# EAGLE design connector_boards (EAGLE 9.1.3)
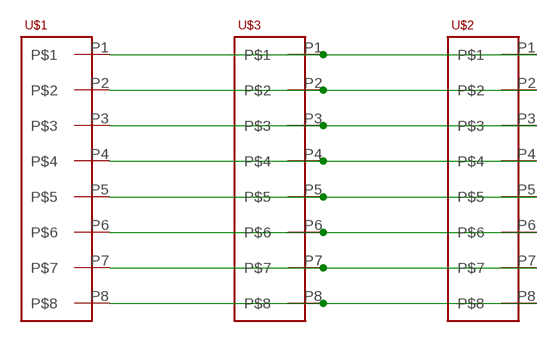
[diagram p0: schematic, sheet 1]

## Parts
U$1  8-PIN-MOLEX-RA-FEMALE  [8-PIN-MOLEX]
U$2  8-PIN-MOLEX-RA-FEMALE  [8-PIN-MOLEX]
U$3  8-PIN-MOLEX-RA-FEMALE  [8-PIN-MOLEX]

## Nets
N$1: U$1.P1 U$2.P1 U$3.P1
N$2: U$1.P2 U$2.P2 U$3.P2
N$3: U$1.P3 U$2.P3 U$3.P3
N$4: U$1.P4 U$2.P4 U$3.P4
N$5: U$1.P5 U$2.P5 U$3.P5
N$6: U$1.P6 U$2.P6 U$3.P6
N$7: U$1.P7 U$2.P7 U$3.P7
N$8: U$1.P8 U$2.P8 U$3.P8

## Library data of the parts
U$1-U$3 = master_library:8-PIN-MOLEX-RA-FEMALE

## Board
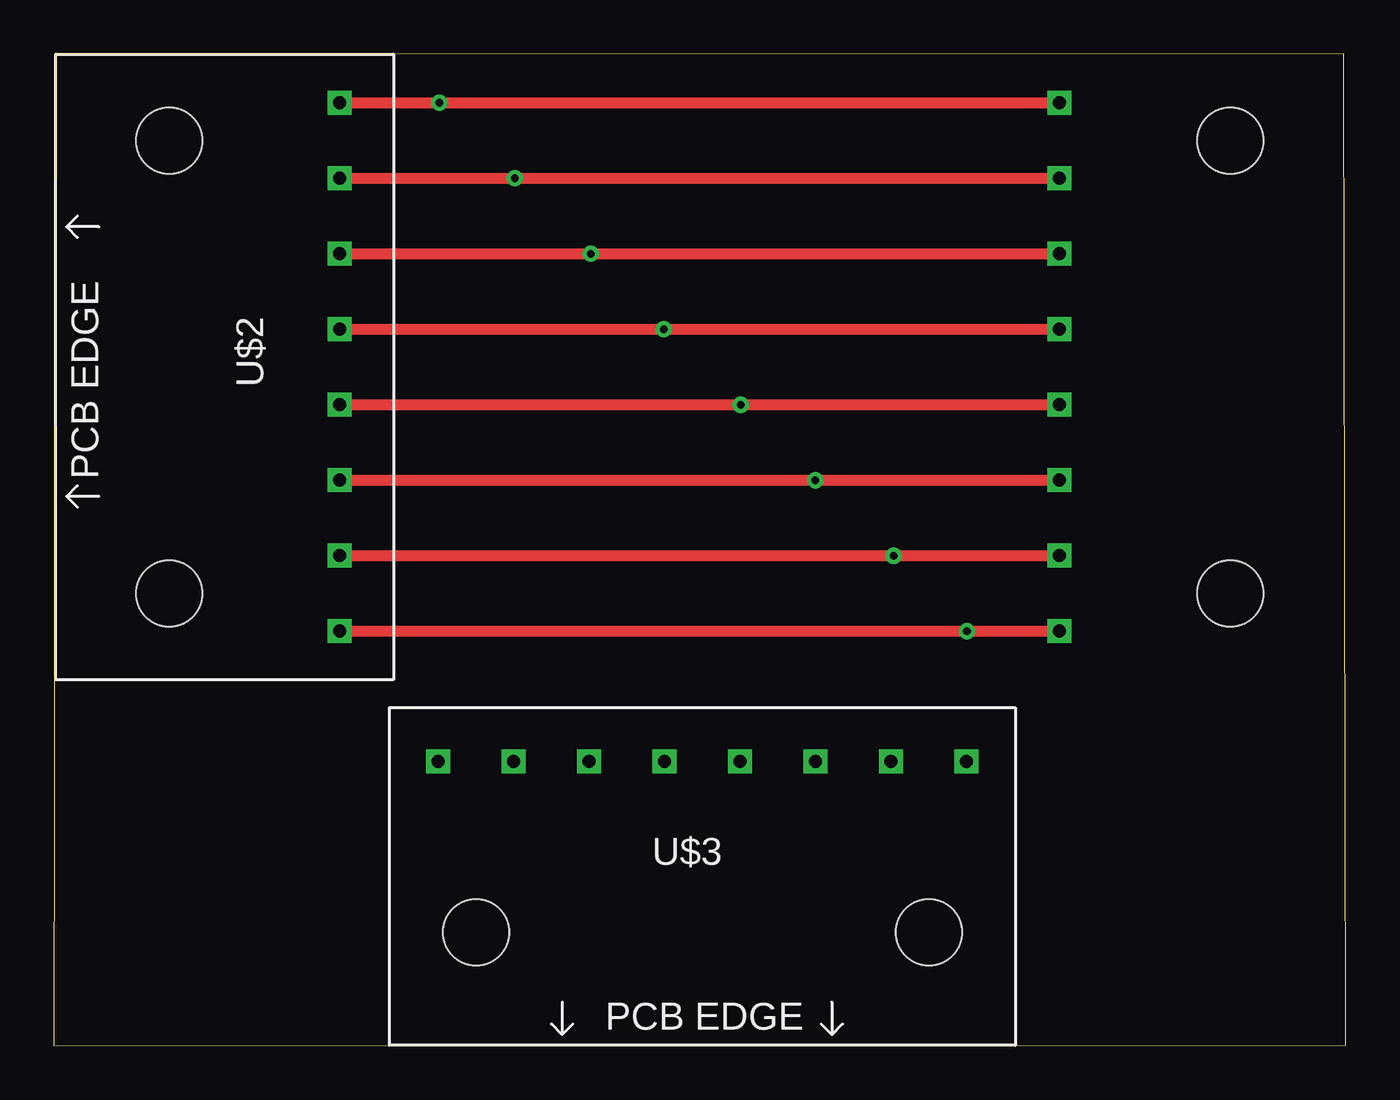
[diagram p1: board, top side]
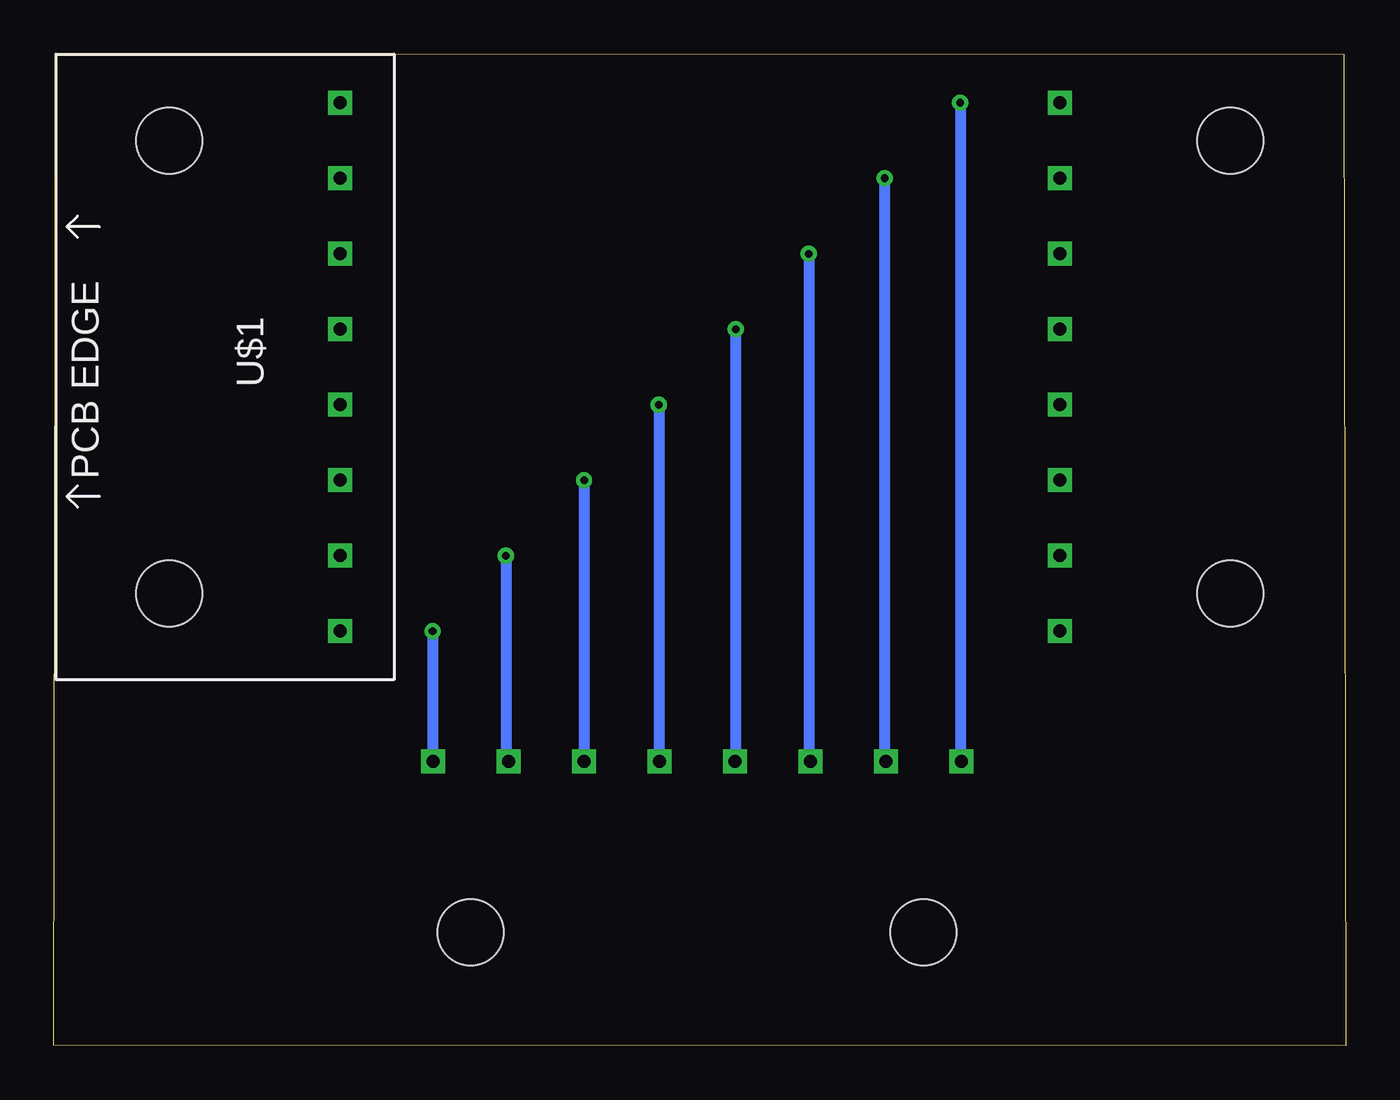
[diagram p2: board, bottom side, seen from below]

Size 59.88 x 45.99 mm. Coordinates in mm from the lower left corner, seen from the top.
Outline: 0,0 59.88,0.03 59.79,45.99 0.09,45.96 0,0
Copper layers (1*16): Top 0.035mm / dielectric 1.5mm / Bottom 0.035mm
Design rules "default": minimum track width 6mil, minimum drill 0.35mm, track to track 6mil, track to pad 6mil, pad to pad 6mil, via to via 6mil, smd to smd 6mil, copper to edge 40mil, drill to drill 6mil, minimum pad ring 10mil, minimum via ring 8mil, stop-mask expansion 4mil, vias tented up to drill 0mil, thermal gap 10mil

### Footprints (pad centres in the part's own frame; a part is rotated, then mirrored left to right if it is on the bottom)
8-PIN-MOLEX = drill 0.6 square: P1 2.248,13.16; P2 5.748,13.16; P3 9.248,13.16; P4 12.748,13.16; P5 16.248,13.16; P6 19.748,13.16; P7 23.248,13.16; P8 26.748,13.16 | hole 3.05: 4,5.25; 25,5.25

### Placement (x,y rotation side)
U$1  59.78,45.97 270 bottom
U$2  0.09,45.97 270 top
U$3  15.56,0.02 0 top

### Tracks (layer width: path | path; a pad name or v marks a point on that pad's centre or on a via)
N$1  (via drill 0.35)
  Top 0.508: U$1.P1 v17.87,43.72 U$2.P1
  Bottom 0.508: v17.87,43.72 17.87,13.24 U$3.P1
N$2  (via drill 0.35)
  Top 0.508: U$1.P2 v21.37,40.22 U$2.P2
  Bottom 0.508: v21.37,40.22 21.37,13.24 U$3.P2
N$3  (via drill 0.35)
  Top 0.508: U$1.P3 v24.88,36.72 U$2.P3
  Bottom 0.508: v24.88,36.72 24.88,13.25 U$3.P3
N$4  (via drill 0.35)
  Top 0.508: U$1.P4 v28.28,33.22 U$2.P4
  Bottom 0.508: v28.28,33.22 28.28,13.21 U$3.P4
N$5  (via drill 0.35)
  Top 0.508: U$1.P5 v31.84,29.72 U$2.P5
  Bottom 0.508: v31.84,29.72 31.84,13.21 U$3.P5
N$6  (via drill 0.35)
  Top 0.508: U$1.P6 v35.3,26.22 U$2.P6
  Bottom 0.508: v35.3,26.22 U$3.P6
N$7  (via drill 0.35)
  Top 0.508: U$1.P7 v38.93,22.72 U$2.P7
  Bottom 0.508: v38.93,22.72 38.93,13.3 U$3.P7
N$8  (via drill 0.35)
  Top 0.508: U$1.P8 v42.32,19.22 U$2.P8
  Bottom 0.508: v42.32,19.22 42.32,13.19 U$3.P8